# EAGLE schematic Precision ATMega32U4 Copernicus (EAGLE 6.2)
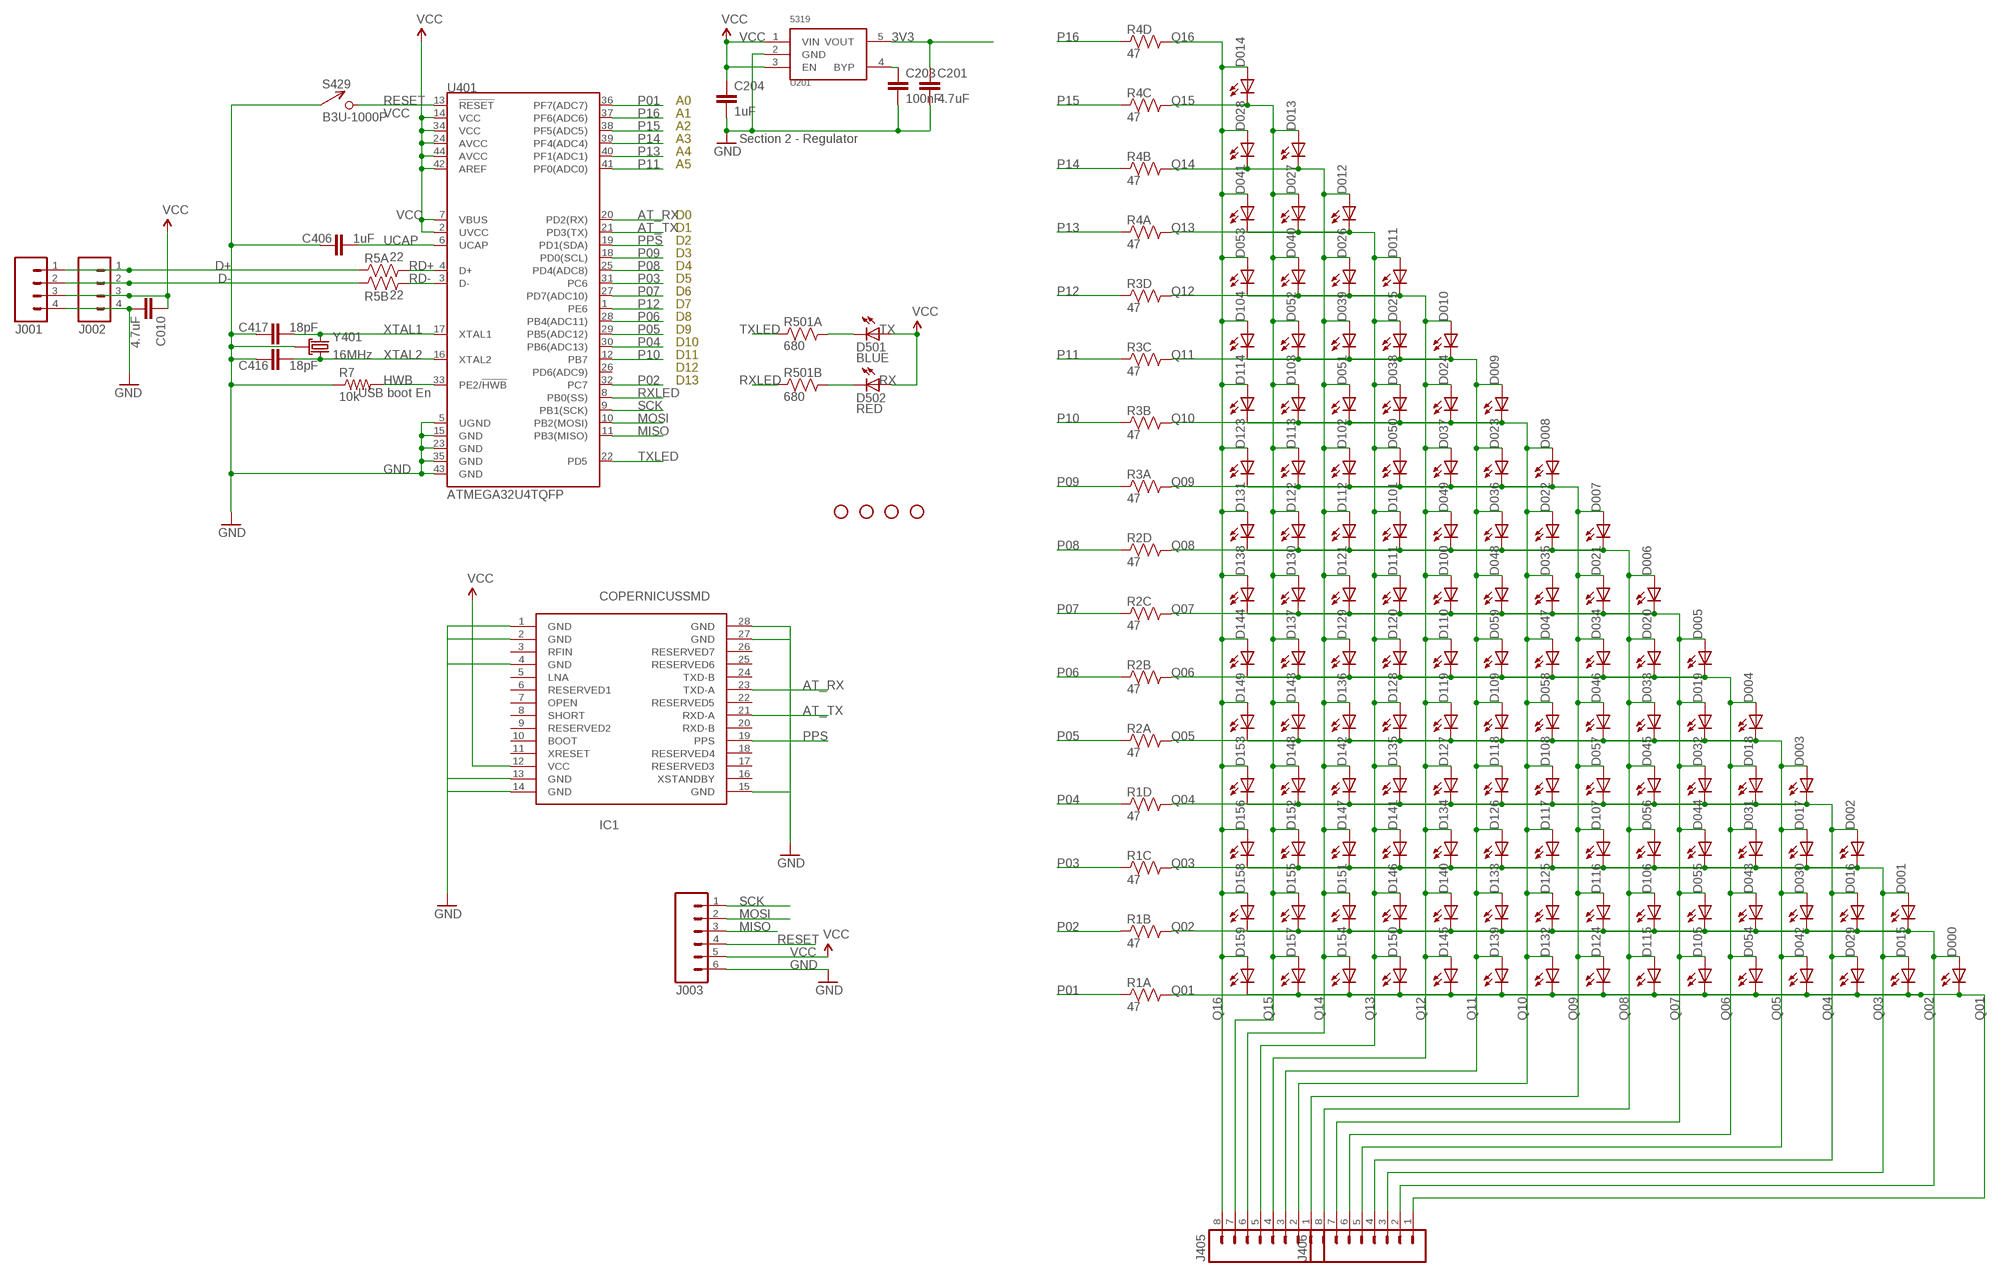
[diagram p0: schematic, sheet 1]

## Parts
C010  4.7uF  CAP0603-CAP  [0603-CAP]
C201  4.7uF  CAP0402-CAP  [0402-CAP]
C203  100nF  CAP0402-CAP  [0402-CAP]
C204  1uF  CAP0402-CAP  [0402-CAP]
C406  1uF  CAP0603-CAP  [0603-CAP]
C416  18pF  CAP0603-CAP  [0603-CAP]
C417  18pF  CAP0603-CAP  [0603-CAP]
D000  HOUR  LED0603  [LED-0603]
D001  HOUR  LED0603  [LED-0603]
D002  HOUR  LED0603  [LED-0603]
D003  HOUR  LED0603  [LED-0603]
D004  HOUR  LED0603  [LED-0603]
D005  HOUR  LED0603  [LED-0603]
D006  HOUR  LED0603  [LED-0603]
D007  HOUR  LED0603  [LED-0603]
D008  HOUR  LED0603  [LED-0603]
D009  HOUR  LED0603  [LED-0603]
D010  HOUR  LED0603  [LED-0603]
D011  HOUR  LED0603  [LED-0603]
D012  HOUR  LED0603  [LED-0603]
D013  HOUR  LED0603  [LED-0603]
D014  HOUR  LED0603  [LED-0603]
D015  HOUR  LED0603  [LED-0603]
D016  HOUR  LED0603  [LED-0603]
D017  HOUR  LED0603  [LED-0603]
D018  HOUR  LED0603  [LED-0603]
D019  HOUR  LED0603  [LED-0603]
D020  HOUR  LED0603  [LED-0603]
D021  HOUR  LED0603  [LED-0603]
D022  HOUR  LED0603  [LED-0603]
D023  HOUR  LED0603  [LED-0603]
D024  HOUR  LED0603  [LED-0603]
D025  HOUR  LED0603  [LED-0603]
D026  HOUR  LED0603  [LED-0603]
D027  HOUR  LED0603  [LED-0603]
D028  HOUR  LED0603  [LED-0603]
D029  HOUR  LED0603  [LED-0603]
D030  HOUR  LED0603  [LED-0603]
D031  HOUR  LED0603  [LED-0603]
D032  HOUR  LED0603  [LED-0603]
D033  HOUR  LED0603  [LED-0603]
D034  HOUR  LED0603  [LED-0603]
D035  HOUR  LED0603  [LED-0603]
D036  HOUR  LED0603  [LED-0603]
D037  HOUR  LED0603  [LED-0603]
D038  HOUR  LED0603  [LED-0603]
D039  HOUR  LED0603  [LED-0603]
D040  HOUR  LED0603  [LED-0603]
D041  HOUR  LED0603  [LED-0603]
D042  HOUR  LED0603  [LED-0603]
D043  HOUR  LED0603  [LED-0603]
D044  HOUR  LED0603  [LED-0603]
D045  HOUR  LED0603  [LED-0603]
D046  HOUR  LED0603  [LED-0603]
D047  HOUR  LED0603  [LED-0603]
D048  HOUR  LED0603  [LED-0603]
D049  HOUR  LED0603  [LED-0603]
D050  HOUR  LED0603  [LED-0603]
D051  HOUR  LED0603  [LED-0603]
D052  HOUR  LED0603  [LED-0603]
D053  HOUR  LED0603  [LED-0603]
D054  HOUR  LED0603  [LED-0603]
D055  HOUR  LED0603  [LED-0603]
D056  HOUR  LED0603  [LED-0603]
D057  HOUR  LED0603  [LED-0603]
D058  HOUR  LED0603  [LED-0603]
D059  HOUR  LED0603  [LED-0603]
D100  HOUR  LED0603  [LED-0603]
D101  HOUR  LED0603  [LED-0603]
D102  HOUR  LED0603  [LED-0603]
D103  HOUR  LED0603  [LED-0603]
D104  HOUR  LED0603  [LED-0603]
D105  HOUR  LED0603  [LED-0603]
D106  HOUR  LED0603  [LED-0603]
D107  HOUR  LED0603  [LED-0603]
D108  HOUR  LED0603  [LED-0603]
D109  HOUR  LED0603  [LED-0603]
D110  HOUR  LED0603  [LED-0603]
D111  HOUR  LED0603  [LED-0603]
D112  HOUR  LED0603  [LED-0603]
D113  HOUR  LED0603  [LED-0603]
D114  HOUR  LED0603  [LED-0603]
D115  HOUR  LED0603  [LED-0603]
D116  HOUR  LED0603  [LED-0603]
D117  HOUR  LED0603  [LED-0603]
D118  HOUR  LED0603  [LED-0603]
D119  HOUR  LED0603  [LED-0603]
D120  HOUR  LED0603  [LED-0603]
D121  HOUR  LED0603  [LED-0603]
D122  HOUR  LED0603  [LED-0603]
D123  HOUR  LED0603  [LED-0603]
D124  HOUR  LED0603  [LED-0603]
D125  HOUR  LED0603  [LED-0603]
D126  HOUR  LED0603  [LED-0603]
D127  HOUR  LED0603  [LED-0603]
D128  HOUR  LED0603  [LED-0603]
D129  HOUR  LED0603  [LED-0603]
D130  HOUR  LED0603  [LED-0603]
D131  HOUR  LED0603  [LED-0603]
D132  HOUR  LED0603  [LED-0603]
D133  HOUR  LED0603  [LED-0603]
D134  HOUR  LED0603  [LED-0603]
D135  HOUR  LED0603  [LED-0603]
D136  HOUR  LED0603  [LED-0603]
D137  HOUR  LED0603  [LED-0603]
D138  HOUR  LED0603  [LED-0603]
D139  HOUR  LED0603  [LED-0603]
D140  HOUR  LED0603  [LED-0603]
D141  HOUR  LED0603  [LED-0603]
D142  HOUR  LED0603  [LED-0603]
D143  HOUR  LED0603  [LED-0603]
D144  HOUR  LED0603  [LED-0603]
D145  HOUR  LED0603  [LED-0603]
D146  HOUR  LED0603  [LED-0603]
D147  HOUR  LED0603  [LED-0603]
D148  HOUR  LED0603  [LED-0603]
D149  HOUR  LED0603  [LED-0603]
D150  HOUR  LED0603  [LED-0603]
D151  HOUR  LED0603  [LED-0603]
D152  HOUR  LED0603  [LED-0603]
D153  HOUR  LED0603  [LED-0603]
D154  HOUR  LED0603  [LED-0603]
D155  HOUR  LED0603  [LED-0603]
D156  HOUR  LED0603  [LED-0603]
D157  HOUR  LED0603  [LED-0603]
D158  HOUR  LED0603  [LED-0603]
D159  HOUR  LED0603  [LED-0603]
D501  BLUE  LED0603  [LED-0603]
D502  RED  LED0603  [LED-0603]
IC1  COPERNICUSSMD  [COPERNICUS]
J001  M04PTH  [1X04]
J002  M04PTH  [1X04]
J003  M06SIP  [1X06]
J405  M081X08  [1X08]
J406  M081X08  [1X08]
JP1  STAND-OFF  [STAND-OFF]
JP2  STAND-OFF  [STAND-OFF]
JP3  STAND-OFF  [STAND-OFF]
JP4  STAND-OFF  [STAND-OFF]
R1  47  RP404  [CRA04]
R2  47  RP404  [CRA04]
R3  47  RP404  [CRA04]
R4  47  RP404  [CRA04]
R5  22  RP2EXB24V  [CRA02]
R7  10k  RESISTOR0603-RES  [0603-RES]
R501  680  RP2EXB24V  [CRA02]
S429  B3U-1000P  [B3U-1000P]
U201  5319  MIC5319D5  [SOT-23-5]
U401  ATMEGA32U4TQFP  [SPARKFUN-DIGITALIC_TQFP44]
Y401  16MHz  TSX-3225  [CRYSTAL_SMD]

## Nets
3V3: C201.1 U201.5(VOUT)
AT_RX: IC1.23(TXD-A) U401.20(PD2(RX))
AT_TX: IC1.21(RXD-A) U401.21(PD3(TX))
D+: J001.1 J002.1 R5.1
D-: J001.2 J002.2 R5.2
GND [power]: C010.2 C201.2 C203.2 C204.2 C406.2 C416.1 C417.1 IC1.1(GND) IC1.2(GND) IC1.4(GND) IC1.13(GND) IC1.14(GND) IC1.15(GND) IC1.27(GND) IC1.28(GND) J001.4 J002.4 J003.6 R7.1 S429.P$1 U201.2(GND) U401.5(UGND) U401.15(GND) U401.23(GND) U401.35(GND) U401.43(GND) Y401.2(GND) Y401.4(GND)
HWB: R7.2 U401.33(PE2/!HWB)
MISO: J003.3 U401.11(PB3(MISO))
MOSI: J003.2 U401.10(PB2(MOSI))
N$17: C203.1 U201.4(BYP)
P01: R1.1 U401.36(PF7(ADC7))
P02: R1.2 U401.32(PC7)
P03: R1.3 U401.31(PC6)
P04: R1.4 U401.30(PB6(ADC13))
P05: R2.1 U401.29(PB5(ADC12))
P06: R2.2 U401.28(PB4(ADC11))
P07: R2.3 U401.27(PD7(ADC10))
P08: R2.4 U401.25(PD4(ADC8))
P09: R3.1 U401.18(PD0(SCL))
P10: R3.2 U401.12(PB7)
P11: R3.3 U401.41(PF0(ADC0))
P12: R3.4 U401.1(PE6)
P13: R4.1 U401.40(PF1(ADC1))
P14: R4.2 U401.39(PF4(ADC4))
P15: R4.3 U401.38(PF5(ADC5))
P16: R4.4 U401.37(PF6(ADC6))
PPS: IC1.19(PPS) U401.19(PD1(SDA))
Q01: D000.C D015.C D029.C D042.C D054.C D105.C D115.C D124.C D132.C D139.C D145.C D150.C D154.C D157.C D159.C J406.1 R1.8
Q02: D000.A D001.C D016.C D030.C D043.C D055.C D106.C D116.C D125.C D133.C D140.C D146.C D151.C D155.C D158.C J406.2 R1.7
Q03: D001.A D002.C D015.A D017.C D031.C D044.C D056.C D107.C D117.C D126.C D134.C D141.C D147.C D152.C D156.C J406.3 R1.6
Q04: D002.A D003.C D016.A D018.C D029.A D032.C D045.C D057.C D108.C D118.C D127.C D135.C D142.C D148.C D153.C J406.4 R1.5
Q05: D003.A D004.C D017.A D019.C D030.A D033.C D042.A D046.C D058.C D109.C D119.C D128.C D136.C D143.C D149.C J406.5 R2.8
Q06: D004.A D005.C D018.A D020.C D031.A D034.C D043.A D047.C D054.A D059.C D110.C D120.C D129.C D137.C D144.C J406.6 R2.7
Q07: D005.A D006.C D019.A D021.C D032.A D035.C D044.A D048.C D055.A D100.C D105.A D111.C D121.C D130.C D138.C J406.7 R2.6
Q08: D006.A D007.C D020.A D022.C D033.A D036.C D045.A D049.C D056.A D101.C D106.A D112.C D115.A D122.C D131.C J406.8 R2.5
Q09: D007.A D008.C D021.A D023.C D034.A D037.C D046.A D050.C D057.A D102.C D107.A D113.C D116.A D123.C D124.A J405.1 R3.8
Q10: D008.A D009.C D022.A D024.C D035.A D038.C D047.A D051.C D058.A D103.C D108.A D114.C D117.A D125.A D132.A J405.2 R3.7
Q11: D009.A D010.C D023.A D025.C D036.A D039.C D048.A D052.C D059.A D104.C D109.A D118.A D126.A D133.A D139.A J405.3 R3.6
Q12: D010.A D011.C D024.A D026.C D037.A D040.C D049.A D053.C D100.A D110.A D119.A D127.A D134.A D140.A D145.A J405.4 R3.5
Q13: D011.A D012.C D025.A D027.C D038.A D041.C D050.A D101.A D111.A D120.A D128.A D135.A D141.A D146.A D150.A J405.5 R4.8
Q14: D012.A D013.C D026.A D028.C D039.A D051.A D102.A D112.A D121.A D129.A D136.A D142.A D147.A D151.A D154.A J405.6 R4.7
Q15: D013.A D014.C D027.A D040.A D052.A D103.A D113.A D122.A D130.A D137.A D143.A D148.A D152.A D155.A D157.A J405.7 R4.6
Q16: D014.A D028.A D041.A D053.A D104.A D114.A D123.A D131.A D138.A D144.A D149.A D153.A D156.A D158.A D159.A J405.8 R4.5
RD+: R5.4 U401.4(D+)
RD-: R5.3 U401.3(D-)
RESET: J003.4 S429.P$2 U401.13(!RESET)
RXLED: R501.2 U401.8(PB0(SS))
RXLED+: D502.C R501.3
SCK: J003.1 U401.9(PB1(SCK))
TXLED: R501.1 U401.22(PD5)
TXLED+: D501.C R501.4
UCAP: C406.1 U401.6(UCAP)
VCC [power]: C010.1 C204.1 D501.A D502.A IC1.12(VCC) J001.3 J002.3 J003.5 U201.1(VIN) U201.3(EN) U401.2(UVCC) U401.7(VBUS) U401.14(VCC) U401.24(AVCC) U401.34(VCC) U401.42(AREF) U401.44(AVCC)
XTAL1: C417.2 U401.17(XTAL1) Y401.1
XTAL2: C416.2 U401.16(XTAL2) Y401.3
Unconnected: IC1.3(RFIN) IC1.5(LNA) IC1.6(RESERVED1) IC1.7(OPEN) IC1.8(SHORT) IC1.9(RESERVED2) IC1.10(BOOT) IC1.11(XRESET) IC1.16(XSTANDBY) IC1.17(RESERVED3) IC1.18(RESERVED4) IC1.20(RXD-B) IC1.22(RESERVED5) IC1.24(TXD-B) IC1.25(RESERVED6) IC1.26(RESERVED7) U401.26(PD6(ADC9))

## Notes on the sheet
- A0
- A1
- A2
- A3 | Section 2 - Regulator
- A4
- A5
- D0
- D1
- D2
- D3
- D4
- D5
- D6
- D7
- D8
- D9 | TX
- D10
- D11
- D12
- D13 | RX
- USB boot En

## Library data of the parts
C010 C201 C203 C204 C406 C416 C417 = SparkFun:CAP: Capacitor Standard 0603 ceramic capacitor, and 0.1" leaded capacitor.
D000 D001-D009 D010-D059 D100-D159 D501 D502 = SparkFun:LED: LEDs Standard schematic elements and footprints for 5mm, 3mm, 1206, and 0603 sized LEDs. 5mm - Spark Fun Electronics SKU : COM-00529 (and others)
IC1 = SparkFun:COPERNICUS: Copernicus Massively edited and tweaked footprint to meet the Trimble recommended layout and paste layer. Footprint production proven. Spark Fun Electronics SKU : GPS-07951
J001 J002 = SparkFun:M04: Header 4 Standard 4-pin 0.1" header. Use with straight break away headers (SKU : PRT-00116), right angle break away headers (PRT-00553), swiss pins (PRT-00743), machine pins (PRT-00117), and female headers (PRT-00115). Molex polarized connector foot print use with SKU : PRT-08231 with associated crimp pins and housings. 1MM SMD Version SKU: PRT-10208
J003 = SparkFun:M06: Header 6 Standard 6-pin 0.1" header. Use with straight break away headers (SKU : PRT-00116), right angle break away headers (PRT-00553), swiss pins (PRT-00743), machine pins (PRT-00117), and female headers (PRT-00115). Molex polarized connector foot print use with SKU : PRT-08094 with associated crimp pins and housings. NOTES ON THE VARIANTS LOCK and LOCK_LONGPADS... This footprint was designed to help hold the alignment of a through-hole component (i.e. 6-pin header) while soldering it into place. You may notice that each hole has been shifted either up or down by 0.005 of an inch from it's more standard position (which is a perfectly straight line). This slight alteration caused the pins (the squares in the middle) to touch the edges of the holes. Because they are alternating, it causes a "brace" to hold the component in place. 0.005 has proven to be the perfect amount of "off-center" position when using our standard breakaway headers. Although looks a little odd when you look at the bare footprint, once you have a header in there, the alteration is very hard to notice. Also, if you push a header all the way into place, it is covered up entirely on the bottom side. This idea of altering the position of holes to aid alignment will be further integrated into the Sparkfun Library for other footprints. It can help hold any component with 3 or more connection pins.
J405 J406 = SparkFun:M08: Header 8 Standard 8-pin 0.1" header. Use with straight break away headers (SKU : PRT-00116), right angle break away headers (PRT-00553), swiss pins (PRT-00743), machine pins (PRT-00117), and female headers (PRT-00115).
JP1-JP4 = SparkFun:STAND-OFF: Stand Off This is the mechanical footprint for a #4 phillips button head screw. Use the keepout ring to avoid running the screw head into surrounding components. SKU : PRT-00447
R1-R4 = KwanSystems:RP4
R5 R501 = KwanSystems:RP2
R7 = SparkFun-Passives:RESISTOR: Resistor Basic schematic elements and footprints for 0603, 1206, and PTH resistors.
S429 = KwanSystems:B3U-1000P
U201 = KwanSystems:MIC5319
U401 = SparkFun-DigitalIC:ATMEGA32U4: Atmel 44-pin 8-bit Microcontroller with 32KBytes of ISP Flash and USB Controller
Y401 = KwanSystems:TSX-3225

## Net classes
0 default: width 0.152 mm, drill 0.33 mm, clearance 0.152 mm
1 power: width 0.152 mm, drill 0.33 mm, clearance 0.152 mm
2 gnd: width 0.254 mm, drill 0.61 mm, clearance 0.254 mm
3 usbvcc: width 0.254 mm, drill 0.61 mm, clearance 0.254 mm
4 aref: width 0.254 mm, drill 0.61 mm, clearance 0.254 mm